# Altium project SR8_MPPT.PrjPcb (part 2 of 3)

## Sheet microcontroller.SchDoc: Microcontroller
size A3; DrawnBy: Angus Macdonald; SheetNumber: 2; SheetTotal: 5
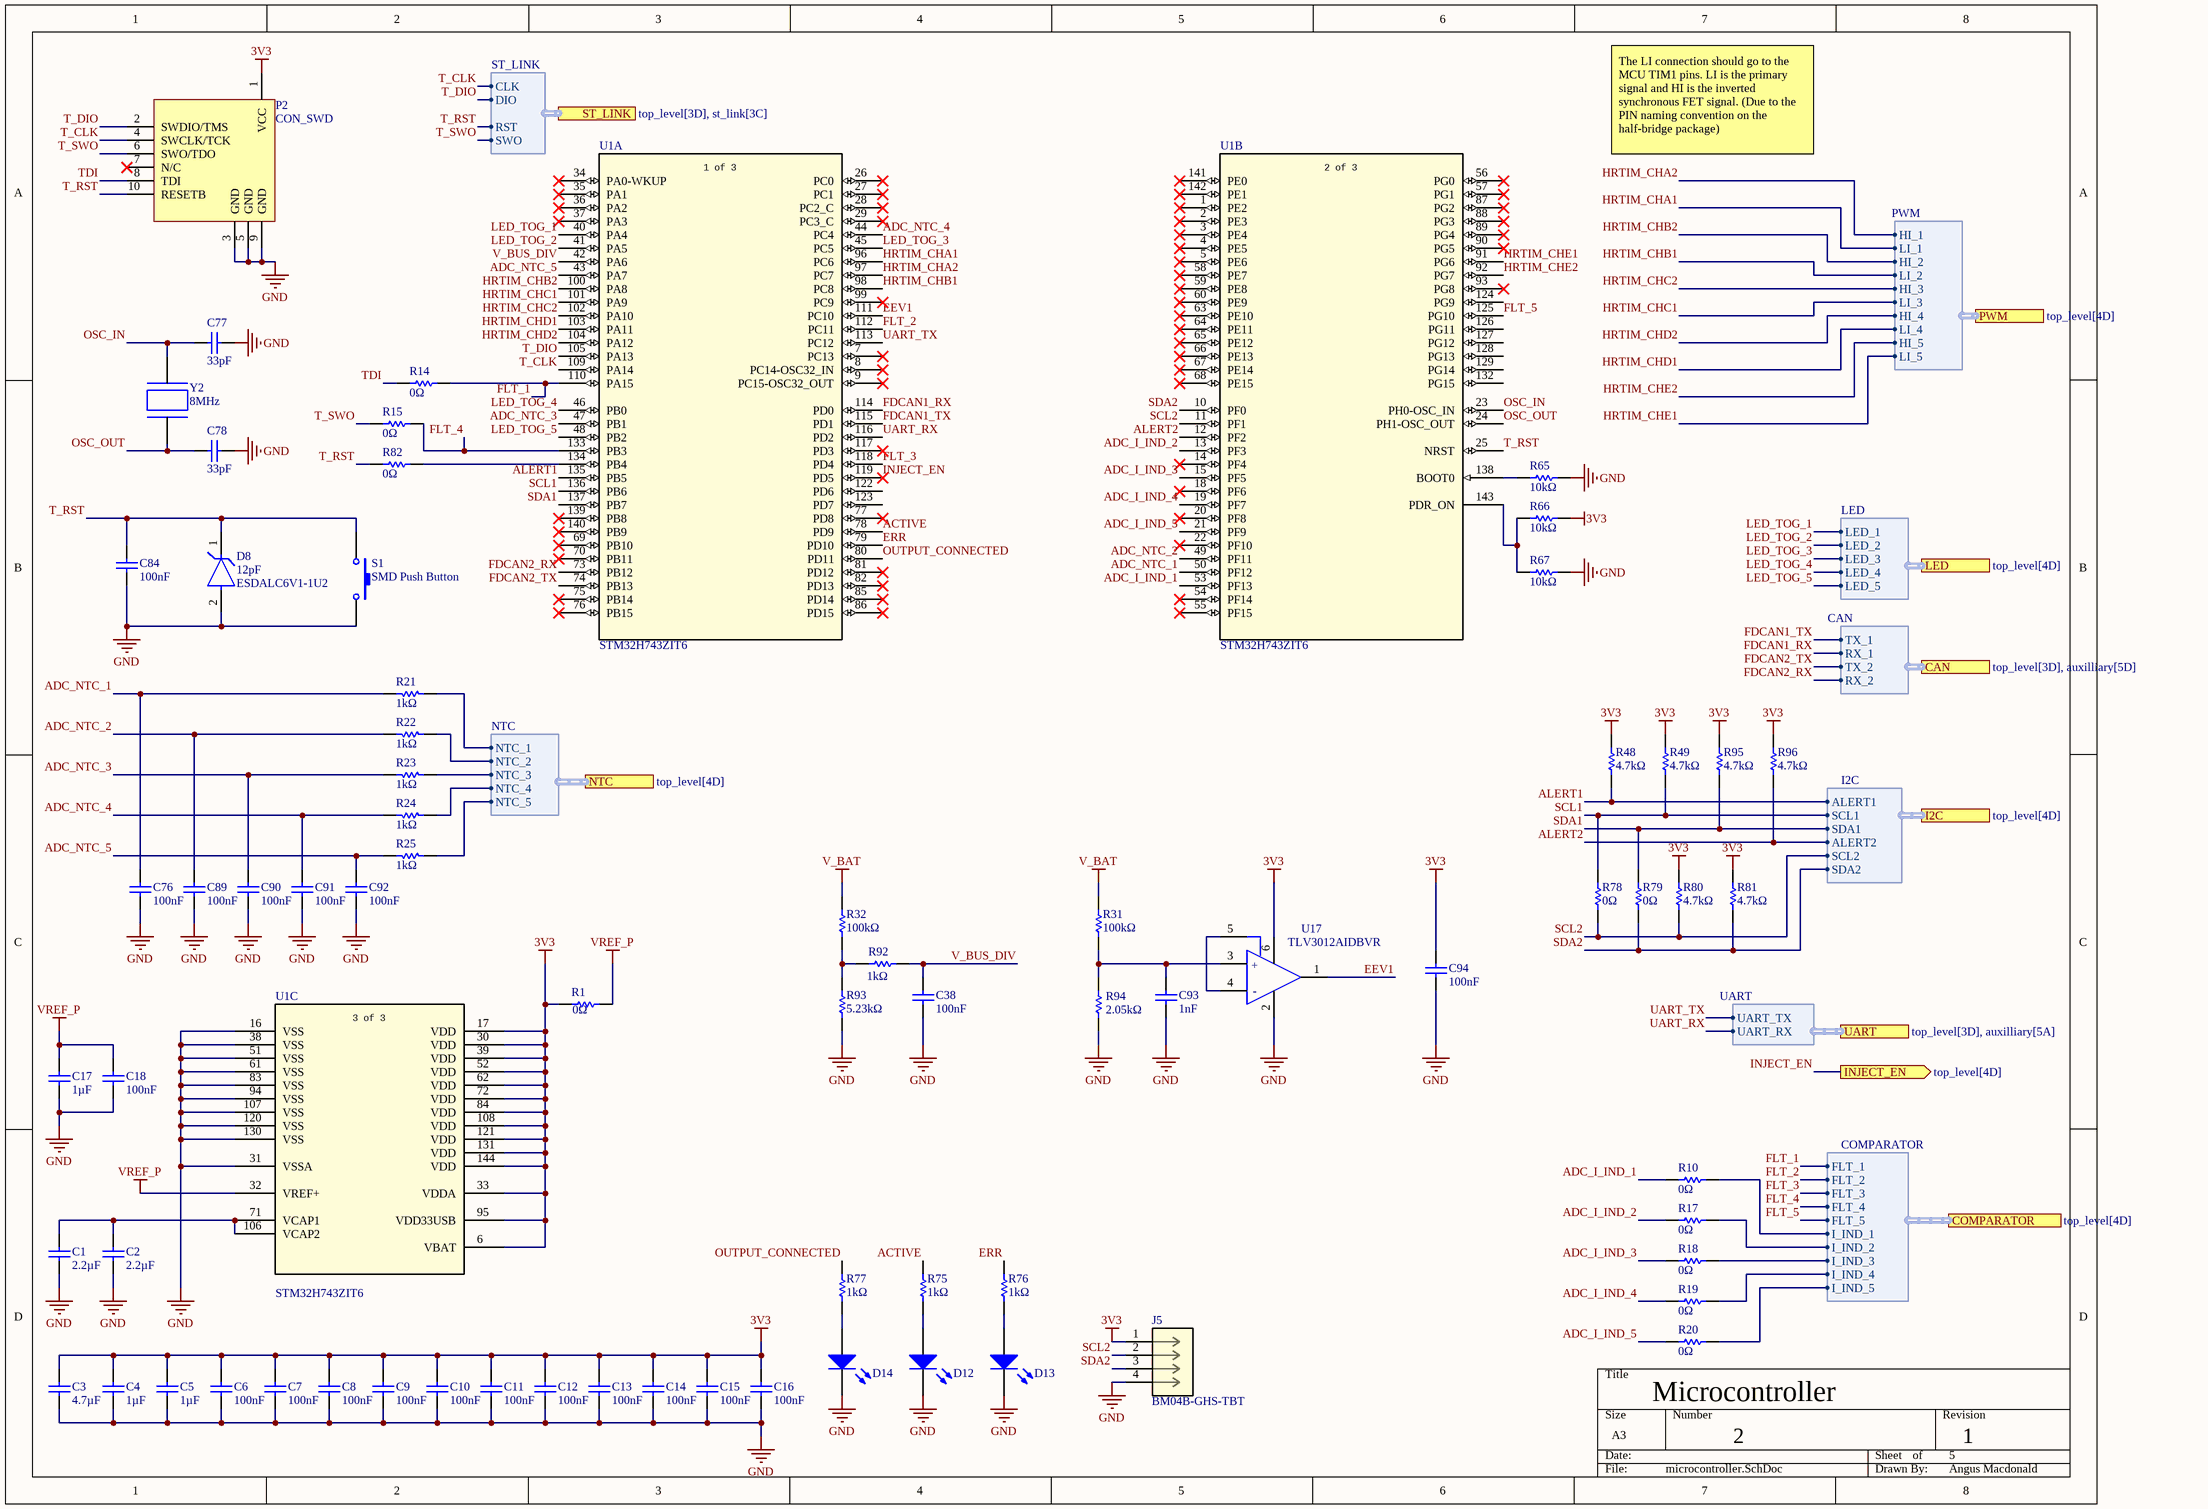
[diagram p2: microcontroller.SchDoc]

### Parts
C1  value 2.2µF  [C0603]  (hidden comment: CC0603KRX7R5BB225)
C2  value 2.2µF  [C0603]  (hidden comment: CC0603KRX7R5BB225)
C3  value 4.7µF  [C0603]  (hidden comment: CC0603MRX7R5BB475)
C4  value 1µF  [C0603]  (hidden comment: CC0603KRX7R7BB105)
C5  value 1µF  [C0603]  (hidden comment: CC0603KRX7R7BB105)
C6  value 100nF  [C0603]  (hidden comment: CC0603KRX7R8BB104)
C7  value 100nF  [C0603]  (hidden comment: CC0603KRX7R8BB104)
C8  value 100nF  [C0603]  (hidden comment: CC0603KRX7R8BB104)
C9  value 100nF  [C0603]  (hidden comment: CC0603KRX7R8BB104)
C10  value 100nF  [C0603]  (hidden comment: CC0603KRX7R8BB104)
C11  value 100nF  [C0603]  (hidden comment: CC0603KRX7R8BB104)
C12  value 100nF  [C0603]  (hidden comment: CC0603KRX7R8BB104)
C13  value 100nF  [C0603]  (hidden comment: CC0603KRX7R8BB104)
C14  value 100nF  [C0603]  (hidden comment: CC0603KRX7R8BB104)
C15  value 100nF  [C0603]  (hidden comment: CC0603KRX7R8BB104)
C16  value 100nF  [C0603]  (hidden comment: CC0603KRX7R8BB104)
C17  value 1µF  [C0603]  (hidden comment: CC0603KRX7R7BB105)
C18  value 100nF  [C0603]  (hidden comment: CC0603KRX7R8BB104)
C38  value 100nF  [C0603]  (hidden comment: CC0603KRX7R8BB104)
C76  value 100nF  [C0603]  (hidden comment: CC0603KRX7R8BB104)
C77  value 33pF  [C0603]  (hidden comment: CC0603JPNPO9BN330)
C78  value 33pF  [C0603]  (hidden comment: CC0603JPNPO9BN330)
C84  value 100nF  [C0603]  (hidden comment: CC0603KRX7R8BB104)
C89  value 100nF  [C0603]  (hidden comment: CC0603KRX7R8BB104)
C90  value 100nF  [C0603]  (hidden comment: CC0603KRX7R8BB104)
C91  value 100nF  [C0603]  (hidden comment: CC0603KRX7R8BB104)
C92  value 100nF  [C0603]  (hidden comment: CC0603KRX7R8BB104)
C93  value 1nF  [C0603]  (hidden comment: CC0603KRX7R9BB102)
C94  value 100nF  [C0603]  (hidden comment: CC0603KRX7R8BB104)
D8  ESDALC6V1-1U2  value 12pF  [FP-ST0201-MFG]
D12  LED EMERALD 0805  [0805 LED]  (value not drawn)
D13  LED RED 0805  [0805 LED]  (value not drawn)
D14  LED EMERALD 0805  [0805 LED]  (value not drawn)
J5  BM04B-GHS-TBT  [CONN_BM04B-GHS-TBT_JST]
P2  CON_SWD  [SMD, P=1.27mm]
R1  value 0Ω  [RESC1608X55X25ML10T15]  (hidden comment: RC0603JR-070RL)
R10  value 0Ω  [RESC1608X55X25ML10T15]  (hidden comment: RC0603JR-070RL)
R14  value 0Ω  [RESC1608X55X25ML10T15]  (hidden comment: RC0603JR-070RL)
R15  value 0Ω  [RESC1608X55X25ML10T15]  (hidden comment: RC0603JR-070RL)
R17  value 0Ω  [RESC1608X55X25ML10T15]  (hidden comment: RC0603JR-070RL)
R18  value 0Ω  [RESC1608X55X25ML10T15]  (hidden comment: RC0603JR-070RL)
R19  value 0Ω  [RESC1608X55X25ML10T15]  (hidden comment: RC0603JR-070RL)
R20  value 0Ω  [RESC1608X55X25ML10T15]  (hidden comment: RC0603JR-070RL)
R21  value 1kΩ  [RESC1608X55X25ML10T15]  (hidden comment: RC0603FR-101KL)
R22  value 1kΩ  [RESC1608X55X25ML10T15]  (hidden comment: RC0603FR-101KL)
R23  value 1kΩ  [RESC1608X55X25ML10T15]  (hidden comment: RC0603FR-101KL)
R24  value 1kΩ  [RESC1608X55X25ML10T15]  (hidden comment: RC0603FR-101KL)
R25  value 1kΩ  [RESC1608X55X25ML10T15]  (hidden comment: RC0603FR-101KL)
R31  value 100kΩ  [RESC1608X55X25ML10T15]  (hidden comment: RC0603FR-07100KL)
R32  value 100kΩ  [RESC1608X55X25ML10T15]  (hidden comment: RC0603FR-07100KL)
R48  value 4.7kΩ  [RESC1608X55X25ML10T15]  (hidden comment: RC0603FR-074K7L)
R49  value 4.7kΩ  [RESC1608X55X25ML10T15]  (hidden comment: RC0603FR-074K7L)
R65  value 10kΩ  [RESC1608X55X25ML10T15]  (hidden comment: RC0603FR-0710KL)
R66  value 10kΩ  [RESC1608X55X25ML10T15]  (hidden comment: RC0603FR-0710KL)
R67  value 10kΩ  [RESC1608X55X25ML10T15]  (hidden comment: RC0603FR-0710KL)
R75  value 1kΩ  [RESC1608X55X25ML10T15]  (hidden comment: RC0603FR-101KL)
R76  value 1kΩ  [RESC1608X55X25ML10T15]  (hidden comment: RC0603FR-101KL)
R77  value 1kΩ  [RESC1608X55X25ML10T15]  (hidden comment: RC0603FR-101KL)
R78  value 0Ω  [RESC1608X55X25ML10T15]  (hidden comment: RC0603JR-070RL)
R79  value 0Ω  [RESC1608X55X25ML10T15]  (hidden comment: RC0603JR-070RL)
R80  value 4.7kΩ  [RESC1608X55X25ML10T15]  (hidden comment: RC0603FR-074K7L)
R81  value 4.7kΩ  [RESC1608X55X25ML10T15]  (hidden comment: RC0603FR-074K7L)
R82  value 0Ω  [RESC1608X55X25ML10T15]  (hidden comment: RC0603JR-070RL)
R92  value 1kΩ  [RESC1608X55X25ML10T15]  (hidden comment: RC0603FR-101KL)
R93  value 5.23kΩ  [RESC1608X55X25ML10T15]  (hidden comment: RC0603FR-135K23L)
R94  value 2.05kΩ  [RESC1608X55X25ML10T15]  (hidden comment: RC0603FR-072K05L)
R95  value 4.7kΩ  [RESC1608X55X25ML10T15]  (hidden comment: RC0603FR-074K7L)
R96  value 4.7kΩ  [RESC1608X55X25ML10T15]  (hidden comment: RC0603FR-074K7L)
S1  SMD Push Button  [SMD Push Button-Footprint-1]
U1  STM32H743ZIT6  [LQFP144-20x20mm]  (parts A,B,C of 3)
U17  TLV3012AIDBVR  [FP-DBV0006A-IPC_B]
Y2  Frequency: 8MHz  [RESC5032X135N]  (hidden comment: X50328MSB2GI)

### Ports
CAN (harness CAN, see top_level[3D], auxilliary[5D]), COMPARATOR (harness COMPARATOR, see top_level[4D]), I2C (harness I2C, see top_level[4D]), INJECT_EN (out, see top_level[4D]), LED (harness LED, see top_level[4D]), NTC (harness NTC, see top_level[4D]), PWM (harness PWM, see top_level[4D]), ST_LINK (harness ST_LINK, see top_level[3D], st_link[3C]), UART (harness UART, see top_level[3D], auxilliary[5A])

### Harnesses
PWM: HI_1, HI_2, HI_3, HI_4, HI_5, LI_1, LI_2, LI_3, LI_4, LI_5
ST_LINK: CLK, DIO, RST, SWO
NTC: NTC_1, NTC_2, NTC_3, NTC_4, NTC_5
LED: LED_1, LED_2, LED_3, LED_4, LED_5
CAN: TX_1, RX_1, TX_2, RX_2
UART: UART_TX, UART_RX
I2C: ALERT1, SCL1, SDA1, ALERT2, SCL2, SDA2
COMPARATOR: FLT_1, FLT_2, FLT_3, FLT_4, FLT_5, I_IND_1, I_IND_2, I_IND_3, I_IND_4, I_IND_5

### Nets
3V3: C3.2 C4.2 C5.2 C6.2 C7.2 C8.2 C9.2 C10.2 C11.2 C12.2 C13.2 C14.2 C15.2 C16.2 C94.2 J5.1 P2.1(VCC) R1.1 R48.2 R49.2 R66.1 R80.2 R81.2 R95.2 R96.2 U1.6(VBAT) U1.17(VDD) U1.30(VDD) U1.33(VDDA) U1.39(VDD) U1.52(VDD) U1.62(VDD) U1.72(VDD) U1.84(VDD) U1.95(VDD33USB) U1.108(VDD) U1.121(VDD) U1.131(VDD) U1.144(VDD) U17.6(V+)
GND: C1.2 C2.2 C3.1 C4.1 C5.1 C6.1 C7.1 C8.1 C9.1 C10.1 C11.1 C12.1 C13.1 C14.1 C15.1 C16.1 C17.1 C18.1 C38.1 C76.1 C77.1 C78.1 C84.1 C89.1 C90.1 C91.1 C92.1 C93.1 C94.1 D8.2(A) D12.K D13.K D14.K J5.4 P2.3(GND) P2.5(GND) P2.9(GND) R65.2 R67.2 R93.1 R94.1 S1.2 U1.16(VSS) U1.31(VSSA) U1.38(VSS) U1.51(VSS) U1.61(VSS) U1.83(VSS) U1.94(VSS) U1.107(VSS) U1.120(VSS) U1.130(VSS) U17.2(V-)
V_BAT: R31.2 R32.2
VREF_P: C17.2 C18.2 R1.2 U1.32(VREF+)
ACTIVE: R75.1 U1.78(PD9)
ADC_I_IND_1: R10.2 U1.53(PF13)
ADC_I_IND_2: R17.2 U1.13(PF3)
ADC_I_IND_3: R18.2 U1.15(PF5)
ADC_I_IND_4: R19.2 U1.19(PF7)
ADC_I_IND_5: R20.2 U1.21(PF9)
ADC_NTC_1: C76.2 R21.2 U1.50(PF12)
ADC_NTC_2: C89.2 R22.2 U1.49(PF11)
ADC_NTC_3: C90.2 R23.2 U1.47(PB1)
ADC_NTC_4: C91.2 R24.2 U1.44(PC4)
ADC_NTC_5: C92.2 R25.2 U1.43(PA7)
ALERT1: R48.1 U1.135(PB5) ; port I2C.ALERT1
ALERT2: R96.1 U1.12(PF2) ; port I2C.ALERT2
EEV1: U1.111(PC10) U17.1(OUT)
ERR: R76.2 U1.79(PD10)
FDCAN1_RX: U1.114(PD0) ; port CAN.RX_1
FDCAN1_TX: U1.115(PD1) ; port CAN.TX_1
FDCAN2_RX: U1.73(PB12) ; port CAN.RX_2
FDCAN2_TX: U1.74(PB13) ; port CAN.TX_2
FLT_1: R14.1 U1.110(PA15) ; port COMPARATOR.FLT_1
FLT_2: U1.112(PC11) ; port COMPARATOR.FLT_2
FLT_3: U1.118(PD4) ; port COMPARATOR.FLT_3
FLT_4: R15.1 U1.133(PB3) ; port COMPARATOR.FLT_4
FLT_5: U1.125(PG10) ; port COMPARATOR.FLT_5
HRTIM_CHA1: U1.96(PC6) ; port PWM.LI_1  [project net LI_1]
HRTIM_CHA2: U1.97(PC7) ; port PWM.HI_1  [project net HI_1]
HRTIM_CHB1: U1.98(PC8) ; port PWM.LI_2  [project net LI_2]
HRTIM_CHB2: U1.100(PA8) ; port PWM.HI_2  [project net HI_2]
HRTIM_CHC1: U1.101(PA9) ; port PWM.LI_3  [project net LI_3]
HRTIM_CHC2: U1.102(PA10) ; port PWM.HI_3  [project net HI_3]
HRTIM_CHD1: U1.103(PA11) ; port PWM.LI_4  [project net LI_4]
HRTIM_CHD2: U1.104(PA12) ; port PWM.HI_4  [project net HI_4]
HRTIM_CHE1: U1.91(PG6) ; port PWM.LI_5  [project net LI_5]
HRTIM_CHE2: U1.92(PG7) ; port PWM.HI_5  [project net HI_5]
I_IND_1: R10.1 ; port COMPARATOR.I_IND_1
I_IND_2: R17.1 ; port COMPARATOR.I_IND_2
I_IND_3: R18.1 ; port COMPARATOR.I_IND_3
I_IND_4: R19.1 ; port COMPARATOR.I_IND_4
I_IND_5: R20.1 ; port COMPARATOR.I_IND_5
INJECT_EN: U1.119(PD5) ; port INJECT_EN
LED_TOG_1: U1.40(PA4) ; port LED.LED_1
LED_TOG_2: U1.41(PA5) ; port LED.LED_2
LED_TOG_3: U1.45(PC5) ; port LED.LED_3
LED_TOG_4: U1.46(PB0) ; port LED.LED_4
LED_TOG_5: U1.48(PB2) ; port LED.LED_5
NTC_1: R21.1 ; port NTC.NTC_1
NTC_2: R22.1 ; port NTC.NTC_2
NTC_3: R23.1 ; port NTC.NTC_3
NTC_4: R24.1 ; port NTC.NTC_4
NTC_5: R25.1 ; port NTC.NTC_5
OSC_IN: C77.2 U1.23(PH0-OSC_IN) Y2.2
OSC_OUT: C78.2 U1.24(PH1-OSC_OUT) Y2.1
OUTPUT_CONNECTED: R77.1 U1.80(PD11)
SCL1: R49.1 R78.2 U1.136(PB6) ; port I2C.SCL1
SCL2: J5.2 R78.1 R80.1 U1.11(PF1) ; port I2C.SCL2
SDA1: R79.2 R95.1 U1.137(PB7) ; port I2C.SDA1
SDA2: J5.3 R79.1 R81.1 U1.10(PF0) ; port I2C.SDA2
T_CLK: P2.4(SWCLK/TCK) U1.109(PA14) ; port ST_LINK.CLK
T_DIO: P2.2(SWDIO/TMS) U1.105(PA13) ; port ST_LINK.DIO
T_RST: C84.2 D8.1(C) P2.10(RESETB) R82.2 S1.1 U1.25(NRST) ; port ST_LINK.RST
T_SWO: P2.6(SWO/TDO) R15.2 ; port ST_LINK.SWO
TDI: P2.8(TDI) R14.2
UART_RX: U1.116(PD2) ; port UART.UART_RX
UART_TX: U1.113(PC12) ; port UART.UART_TX
V_BUS_DIV: C38.2 R92.2 U1.42(PA6)
NetC1_1: C1.1 C2.1 U1.71(VCAP1) U1.106(VCAP2)
NetC93_2: C93.2 R31.1 R94.2 U17.3(IN+)
NetD12_A: D12.A R75.2
NetD13_A: D13.A R76.1
NetD14_A: D14.A R77.2
NetR32_1: R32.1 R92.1 R93.2
NetR65_1: R65.1 U1.138(BOOT0)
NetR66_2: R66.2 R67.1 U1.143(PDR_ON)
NetR82_1: R82.1 U1.134(PB4)
NetU17_4: U17.4(IN-) U17.5(REF)

Not connected (* = marked no-connect by the designer): P2 7(N/C)*; U1 1(PE2)* 2(PE3)* 3(PE4)* 4(PE5)* 5(PE6)* 7(PC13)* 8(PC14-OSC32_IN)* 9(PC15-OSC32_OUT)* 14(PF4)* 18(PF6)* 20(PF8)* 22(PF10)* 26(PC0)* 27(PC1)* 28(PC2_C)* 29(PC3_C)* 34(PA0-WKUP)* 35(PA1)* 36(PA2)* 37(PA3)* 54(PF14)* 55(PF15)* 56(PG0)* 57(PG1)* 58(PE7)* 59(PE8)* 60(PE9)* 63(PE10)* 64(PE11)* 65(PE12)* 66(PE13)* 67(PE14)* 68(PE15)* 69(PB10)* 70(PB11)* 75(PB14)* 76(PB15)* 77(PD8)* 81(PD12)* 82(PD13)* 85(PD14)* 86(PD15)* 87(PG2)* 88(PG3)* 89(PG4)* 90(PG5)* 93(PG8)* 99(PC9)* 117(PD3)* 122(PD6) 123(PD7) 124(PG9) 126(PG11) 127(PG12) 128(PG13) 129(PG14) 132(PG15) 139(PB8)* 140(PB9)* 141(PE0)* 142(PE1)*

### Notes on the sheet
- The LI connection should go to the MCU TIM1 pins. LI is the primary signal and HI is the inverted synchronous FET signal. (Due to the PIN naming convention on the half-bridge package)
- (in symbol CMP-015-000045-1, part A) 1 of 3
- (in symbol CMP-015-000045-1, part B) 2 of 3
- (in symbol CMP-015-000045-1, part C) 3 of 3
- (in symbol CMP-365-000001-1) +; -

### Library data of the parts
C1 C2 = CMP-00207-1: 6.3V 2.2uF X7R ±10% 0603 Multilayer Ceramic Capacitors MLCC - SMD/SMT ROHS; Width: 800µm; Depth: 800µm; Packaging: Tape and Reel; Schedule B: 8532240020, 8532240020; Case Code (Imperial): 0603; Country of Origin: Mainland China, Taiwan; Halogen Free: Halogen Free; Length: 1.6mm; Lifecycle Status: Production; Dielectric Material: Ceramic; Min Operating Temperature: -55°C; Lead Free: Lead Free; Case/Package: 0603; Composition: Ceramic; Material: Ceramic; Termination: SMD/SMT; Radiation Hardening: No; Harmonized Tariff Schedule (HTS) Code: 8532.24.00.20; Thickness: 889µm; Mounting Technology: Surface Mount; Number of Terminals: 2; China RoHS: Compliant; Case Code (Metric): 1608; Introduction Date: 2009-04-17; RoHS: Compliant; Tolerance: 10%; REACH SVHC: Yes; Height: 800µm; Dielectric: X7R; Export Control Classification Number (ECCN) Code: EAR99; Voltage Rating (DC): 6.3V; Voltage Rating: 6.3V; Max Operating Temperature: 125°C; Weight: 2.012816mg
C3 = CMP-00209-1: Multilayer Ceramic Capacitors MLCC - SMD/SMT 6.3V 4.7uF X7R 0603 20%; Halogen Free: Halogen Free; Introduction Date: 2012-07-17; Number of Terminals: 2; Export Control Classification Number (ECCN) Code: EAR99; Tolerance: 20%; Lead Free: Lead Free; REACH SVHC: Yes; Min Operating Temperature: -55°C; Case/Package: 0603; Country of Origin: Mainland China, Taiwan; Height: 800µm; Dielectric Material: Ceramic; Mounting Technology: Surface Mount; Harmonized Tariff Schedule (HTS) Code: 8532.24.00.20; Voltage Rating: 6.3V; Lifecycle Status: Production; Dielectric: X7R; Voltage Rating (DC): 6.3V; China RoHS: Compliant; Max Operating Temperature: 125°C; RoHS: Compliant; Length: 1.6mm; Width: 800µm; Material: Ceramic; Schedule B: 8532240020
C4 C5 C17 = CMP-00211-1: 16V 1uF X7R ±10% 0603 Multilayer Ceramic Capacitors MLCC - SMD/SMT ROHS; Dissipation Factor: 5%; Harmonized Tariff Schedule (HTS) Code: 8532.24.00.20; Width: 800µm; Country of Origin: Mainland China, Taiwan; Case Code (Imperial): 0603; Schedule B: 8532240020, 8532240020; Halogen Free: Halogen Free; Lifecycle Status: Production; China RoHS: Compliant; Max Operating Temperature: 125°C; Export Control Classification Number (ECCN) Code: EAR99; Min Operating Temperature: -55°C; Radiation Hardening: No; Dielectric Material: Ceramic; Voltage: 16V; RoHS: Compliant; Voltage Rating (DC): 16V; Termination: SMD/SMT; Material: Ceramic; Mounting Technology: Surface Mount; Case Code (Metric): 1608; Case/Package: 0603; Depth: 800µm; Voltage Rating: 16V; Dielectric: X7R; Thickness: 889µm; Lead Free: Lead Free; Length: 1.6mm; REACH SVHC: Yes; Height: 800µm; Introduction Date: 2009-04-17; Tolerance: 10%; Composition: Ceramic; Number of Terminals: 2; Pins: 2
C6-C16 C18 C38 C76 C84 C89-C92 C94 = CMP-00179-1: 25V 100nF X7R ±10% 0603 Multilayer Ceramic Capacitors MLCC - SMD/SMT ROHS; Length: 1.6mm; Pins: 2; Case/Package: 0603; Composition: Ceramic; Lead Free: Lead Free; Lifecycle Status: Production; RoHS: Compliant; China RoHS: Compliant; Number of Terminals: 2; Max Operating Temperature: 125°C; Tolerance: 10%; Width: 800µm; Dielectric Material: Ceramic; Voltage Rating (DC): 25V; Depth: 800µm; Min Operating Temperature: -55°C; Halogen Free: Halogen Free; Mounting Technology: Surface Mount; Material: Ceramic; REACH SVHC: Yes; Case Code (Imperial): 0603; Height: 800µm; Schedule B: 8532240020, 8532240020; Voltage Rating: 25V; Thickness: 889µm; Termination: SMD/SMT; Dielectric: X7R; Radiation Hardening: No; Voltage: 25V; Case Code (Metric): 1608
C77 C78 = CMP-00295-1: 0603 33 pF 50 V ±5 % Tolerance C0G/NP0 SMT Multilayer Ceramic Capacitor; Tolerance: 5%; Voltage Rating (DC): 50V; Dielectric: C0G; Halogen Free: Halogen Free; Depth: 800µm; Export Control Classification Number (ECCN) Code: EAR99; Case/Package: 0603; RoHS: Compliant; Harmonized Tariff Schedule (HTS) Code: 8532.24.00.20; Lifecycle Status: Production; Dielectric Material: Ceramic; Number of Terminals: 2; Width: 800µm; Length: 1.6mm; Mounting Technology: Surface Mount; Composition: Ceramic; Lead Free: Lead Free; Max Operating Temperature: 125°C; Min Operating Temperature: -55°C; Country of Origin: Mainland China, Taiwan; REACH SVHC: Yes; Radiation Hardening: No; China RoHS: Compliant; Packaging: Tape and Reel; Height: 800µm; Introduction Date: 2003-08-13
C93 = CMP-00293-1: Surface Mount Ceramic Multilayer Capacitor 0.001uF 10% X7R 50V 0603 Paper T/R; Insulation Resistance: 100GΩ; Schedule B: 8532240020, 8532240020; Voltage Rating: 50V; Number of Terminals: 2; Voltage: 50V; Pins: 2; Dielectric Material: Ceramic; Case Code (Imperial): 0603; Dielectric: X7R; Thickness: 889µm; Height: 800µm; Length: 1.6mm; REACH SVHC: Yes; Lifecycle Status: Production; China RoHS: Compliant; Depth: 800µm; Lead Free: Lead Free; Termination: SMD/SMT; Max Operating Temperature: 125°C; Width: 800µm; Tolerance: 10%; Voltage Rating (DC): 50V; Mounting Technology: Surface Mount; RoHS: Compliant; Material: Ceramic; Case Code (Metric): 1608; Composition: Ceramic; Halogen Free: Halogen Free; Case/Package: 0603; Min Operating Temperature: -55°C; Radiation Hardening: No
D8 = CMP-002-000051-1: 20W 6.1V 6.1V 3V 0201 ESD and Surge Protection (TVS/ESD) ROHS; Direction: Unidirectional; Max Reverse Leakage Current: 100nA; Number of Channels: 1; Max Breakdown Voltage: 8V; ESD Protection: Yes; Clamping Voltage: 21V; Peak Pulse Current: 2A; Max Junction Temperature (Tj): 125°C; Element Configuration: Single; Power Line Protection: No; Test Current: 1mA; Breakdown Voltage: 7.05V; Depth: 300µm; China RoHS: Compliant; Export Control Classification Number (ECCN) Code: EAR99; Length: 600µm; Width: 350µm; Min Breakdown Voltage: 6.1V; Max Power Dissipation: 20W; Lead Free: Lead Free; RoHS: Compliant; Peak Reverse Current: 100nA; Max Operating Temperature: 125°C; Min Operating Temperature: -40°C; Polarity: Unidirectional; Case Code (Imperial): 0201; Number of Elements: 1; Leakage Current: 100nA; Radiation Hardening: No; Country of Origin: Mainland China; Number of Terminals: 2; Lifecycle Status: Obsolete; Max Repetitive Reverse Voltage (Vrrm): 3V; Schedule B: 8536300000, 8536300000; Number of Unidirectional Channels: 1; Pins: 2; Reverse Standoff Voltage: 3V; Peak Pulse Power: 20W; Harmonized Tariff Schedule (HTS) Code: 8541.10.00.50; Reverse Breakdown Voltage: 6.1V; Termination: SMD/SMT; Mounting Technology: Surface Mount; Case/Package: SMD/SMT; Composition: Zener; Power Dissipation: 20W; REACH SVHC: Yes; Height: 330µm; Introduction Date: 2008-10-13
D12 D14 = CMP-002-000017-2: Emerald 0805  Light Emitting Diodes (LED) ROHS GREEN JLCPCB PICK&PLACE; MFR.Part #: C2297; Manufacturer: Hubei KENTO Elec; Color: Emerald; JLCPCB Part #: C2297
D13 = CMP-002-000018-2: Red 0805  Light Emitting Diodes (LED) ROHS JLCPCB PICK&PLACE; Manufacturer: Foshan NationStar Optoelectronics; MFR.Part #: C84256; JLCPCB Part #: C84256; Color: Red
J5 = CMP-189-000000-2: Description; Manufacturer_Name: JST; Source: BM04B-GHS-TBT.SchLib; Copyright: Copyright (C) 2026 Ultra Librarian. All rights reserved.; Design Item ID: BM04B-GHS-TBT; Type: Type; Manufacturer_Part_Number: BM04B-GHS-TBT; RefDes: RefDes
P2 = CMP-CON-00005-10: ARM Coresight 10 Header; Manufacturer Part Number: 3220-10-0300-00; Value: FTSH-105-01-F-DV-K-P-TR; JLCPCB Part #: C5250218; ComponentLink1Description: Digikey; ComponentLink1URL: https://www.digikey.com.au/en/products/detail/cnc-tech/3220-10-0300-00/3883266?s=N4IgTCBcDaIIxwOwFYC0cBsYCcqByAIiALoC%2BQA
R1 R10 R14 R15 R17-R20 R78 R79 R82 = CMP-RES-00050-1: GENERAL PURPOSE CHIP RESISTOR Metal Glaze/thick Film, 0.1W, 0ohm, Surface Mount, 0603; Power Rating: 100mW; Tolerance: 1%; Voltage Rating: 50V; Temperature Coefficient: 200ppm/°C; Termination: SMD/SMT; Number of Terminals: 2; Pins: 2; Contact Plating: Tin; Case/Package: 0603; Length: 1.6mm; Military Standard: Not; Power Dissipation: 100mW; Introduction Date: 2001-06-08; Case Code (Imperial): 0603; Voltage Rating (DC): 50V; Min Operating Temperature: -55°C; Composition: Thick Film; Export Control Classification Number (ECCN) Code: EAR99; Country of Origin: Mainland China, Taiwan; Height: 450µm; RoHS: Compliant; Depth: 800µm; Lifecycle Status: Production; Width: 800µm; Max Operating Temperature: 155°C; Harmonized Tariff Schedule (HTS) Code: 8533.21.00.30; Radiation Hardening: No; Packaging: Cut Tape; China RoHS: Non-Compliant; Lead Free: Lead Free; REACH SVHC: Yes; Mounting Technology: Surface Mount
R21-R25 R75-R77 R92 = CMP-RES-00029-1: 1 kOhms ±1% 0.1W, 1/10W Chip Resistor 0603 (1608 Metric) Moisture Resistant Thick Film; Case/Package: 0603; Tolerance: 1%
R31 R32 = CMP-RES-00026-1: Res General Purpose Thick Film 0603 100k Ohm 1% 1/10W ±100ppm/°C Molded Paper T/R; Working Voltage: 75V; Voltage Rating (DC): 50V; Power Dissipation: 100mW; Tolerance: 1%; Number of Terminations: 2; Pins: 2; China RoHS: Non-Compliant; Schedule B: 8533210045, 8533210045; Military Standard: Not; Max Operating Temperature: 155°C; Depth: 800µm; Height: 450µm; Voltage Rating: 75V; Case/Package: 0603; Length: 1.6mm; Packaging: Tape & Reel; RoHS: Compliant; Width: 800µm; Power Rating: 100mW; Number of Terminals: 2; Case Code (Imperial): 0603; Lead Free: Lead Free; Termination: SMD/SMT; Case Code (Metric): 0603; Mounting Technology: Surface Mount; Composition: Thick Film; Min Operating Temperature: -55°C; REACH SVHC: Yes; Temperature Coefficient: 100ppm/°C; Lifecycle Status: Production
R48 R49 R80 R81 R95 R96 = CMP-RES-00087-1: Yageo RC0603FR-074K7L Resistor 0603 SMD 4.7k Ohm 1% 100mW Thick Film; Working Voltage: 75V; Voltage Rating (DC): 50V; Temperature Coefficient: 100ppm/°C; Pins: 2; Mounting Technology: Surface Mount; China RoHS: Non-Compliant; Number of Terminals: 2; Radiation Hardening: No; Export Control Classification Number (ECCN) Code: EAR99; Country of Origin: Mainland China, Taiwan; Packaging: Tape & Reel; REACH SVHC: Yes; Composition: Thick Film; Schedule B: 8533210045, 8533210045; Height: 450µm; Case/Package: 0603; Contact Plating: Tin; Tolerance: 1%; Length: 1.6mm; Termination: SMD/SMT; Lead Free: Lead Free; RoHS: Compliant; Power Rating: 100mW; Voltage Rating: 75V; Case Code (Imperial): 0603; Max Operating Temperature: 155°C; Width: 800µm; Depth: 800µm; Lifecycle Status: Production; Harmonized Tariff Schedule (HTS) Code: 8533.21.00.30; Introduction Date: 2004-09-22; Min Operating Temperature: -55°C; Lead Pitch: 300µm; Military Standard: Not
R65-R67 = CMP-RES-00040-1: 10 kOhms ±1% 0.1W, 1/10W Chip Resistor 0603 (1608 Metric) Moisture Resistant Thick Film; Tolerance: 1%; Case/Package: 0603
R93 = CMP-RES-00100-1: 0603 5.23K ohms 1% thick film surface mount chip resistor; Temperature Coefficient: 100ppm/°C; Working Voltage: 75V; Power Rating: 100mW; Voltage Rating: 50V; Mounting Technology: Surface Mount; Contact Plating: Tin; Harmonized Tariff Schedule (HTS) Code: 8533.21.00.30; Number of Terminals: 2; Lifecycle Status: Production; REACH SVHC: Yes; Introduction Date: 2004-09-22; RoHS: Compliant; Radiation Hardening: No; Termination: SMD/SMT; Export Control Classification Number (ECCN) Code: EAR99; Height: 450µm; Country of Origin: Mainland China, Taiwan; Composition: Thick Film; China RoHS: Non-Compliant; Tolerance: 1%; Width: 800µm; Max Operating Temperature: 155°C; Case Code (Imperial): 0603; Min Operating Temperature: -55°C; Case/Package: 0603; Case Code (Metric): 1608; Packaging: Tape & Reel; Length: 1.6mm
R94 = CMP-RES-00099-1: 100mW Thick Film Resistors 75V ±100ppm/℃ ±1% 2.05kΩ 0603 Chip Resistor - Surface Mount ROHS; Temperature Coefficient: 100ppm/°C; Voltage Rating (DC): 50V; Introduction Date: 2004-09-22; Power Rating: 100mW; Number of Terminations: 2; Schedule B: 8533210045, 8533210045; Max Power Dissipation: 100mW; Country of Origin: Mainland China, Taiwan; Number of Terminals: 2; Depth: 800µm; Military Standard: Not; Height: 450µm; Voltage Rating: 75V; Harmonized Tariff Schedule (HTS) Code: 8533.21.00.30; Working Voltage: 75V; Case/Package: 0603; Lifecycle Status: Production; Width: 800µm; Max Operating Temperature: 155°C; Composition: Thick Film; Lead Free: Lead Free; Mounting Technology: Surface Mount; Min Operating Temperature: -55°C; Length: 1.6mm; Export Control Classification Number (ECCN) Code: EAR99; Termination: SMD/SMT; China RoHS: Non-Compliant; REACH SVHC: Yes; Features: Moisture Resistant; Tolerance: 1%; RoHS: Compliant; Case Code (Imperial): 0603
S1 = CMP-011-00000-2: Tactile Switches SPST Rnd Bttn Gull .05A 32VDC 1W SMD; Manufacturer Part Number: KMR221GLFS; JLCPCB Part #: C72443; ComponentLink1URL: https://au.mouser.com/ProductDetail/CK/KMR221GLFS?qs=sb%252But3Lm4x2RtkMQYdEYMA%3D%3D; ComponentLink1Description: Mouser
U1 = CMP-015-000045-1: High-performance and DSP with DP-FPU, Arm Cortex-M7 MCU with 2MBytes of Flash memory, 1MB RAM, 480 MHz CPU, Art Accelerator, L1 cache, external memory interface, large set of peripherals; Manufacturer_Name: STMicroelectronics; Type: Type; Copyright: Copyright (C) 2025 Ultra Librarian. All rights reserved.; RefDes: RefDes; Source: STM32H743ZIT6.SchLib; Manufacturer_Part_Number: STM32H743ZIT6; Design Item ID: STM32H743ZIT6
U17 = CMP-365-000001-1: Low-power comparator with reference (push-pull) 6-SOT-23 -40 to 125; Manufacturer Lifecycle Status: ACTIVE; Input Bias Current: 1pA; Power Supply Rejection Ratio (PSRR): 80dB; Min Supply Voltage: 1.8V; Response Time: 6µs; Number of Channels: 1; Nominal Supply Current: 2.8µA; Output Current: 500µA; Max Junction Temperature (Tj): 150°C; Input Offset Voltage (Vos): 500µV; Common Mode Rejection Ratio: 74dB; Max Input Current: 10pA; Max Supply Voltage: 5.5V; Propagation Delay: 13.5µs; Max Supply Current: 5µA; Thickness: 1.2mm; Radiation Hardening: No; Pins: 6; RoHS: Compliant; Number of Elements: 1; Min Operating Temperature: -40°C; Length: 2.9mm; Max Operating Temperature: 85°C; Contact Plating: Gold; Width: 1.6mm; Case/Package: SOT-23; Lifecycle Status: Production; Mounting Technology: Surface Mount; Lead Free: Lead Free; REACH SVHC: No; Schedule B: 8542390000, 8542390000; Height: 0m; Quiescent Current: 5µA
Y2 = CMP-002-000019-2: 8MHz 20pF ±10ppm SMD5032-2P Crystals ROHS JLCPCB PICK&PLACE; Manufacturer: Yangxing Tech; JLCPCB Part #: C115962; MFR.Part #: X50328MSB2GI

## Sheet st_link.SchDoc: ST-Link
size A3; DrawnBy: Angus Macdonald; SheetNumber: 5; SheetTotal: 5
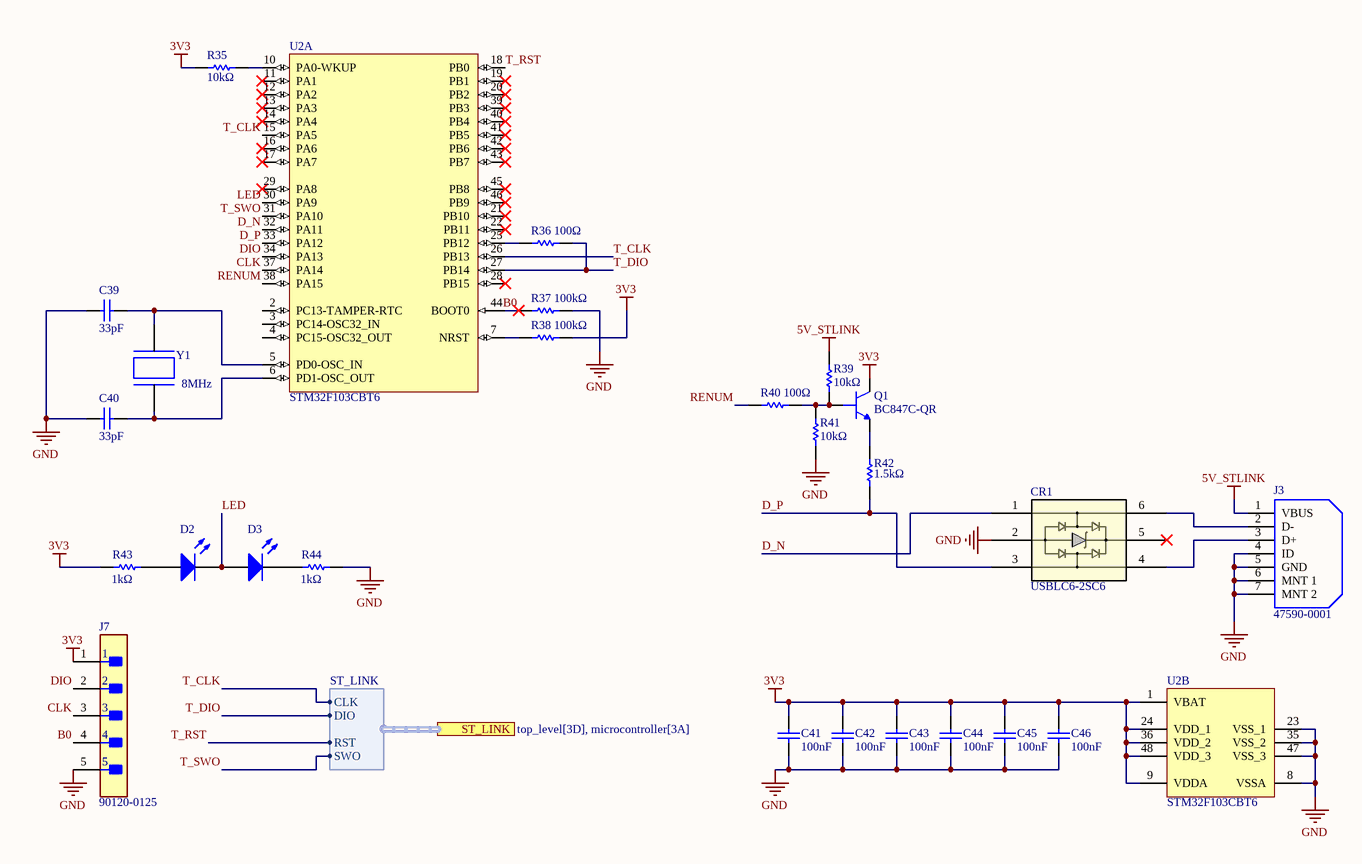
[diagram p3: st_link.SchDoc]

### Parts
C39  value 33pF  [C0603]  (hidden comment: CC0603JPNPO9BN330)
C40  value 33pF  [C0603]  (hidden comment: CC0603JPNPO9BN330)
C41  value 100nF  [C0603]  (hidden comment: CC0603KRX7R8BB104)
C42  value 100nF  [C0603]  (hidden comment: CC0603KRX7R8BB104)
C43  value 100nF  [C0603]  (hidden comment: CC0603KRX7R8BB104)
C44  value 100nF  [C0603]  (hidden comment: CC0603KRX7R8BB104)
C45  value 100nF  [C0603]  (hidden comment: CC0603KRX7R8BB104)
C46  value 100nF  [C0603]  (hidden comment: CC0603KRX7R8BB104)
CR1  USBLC6-2SC6  [SOT23-6L_STM]
D2  LED EMERALD 0805  [0805 LED]  (value not drawn)
D3  LED RED 0805  [0805 LED]  (value not drawn)
J3  47590-0001  [USB]
J7  90120-0125  [FP-90120-0125-MFG]
Q1  BC847C-QR  [TO-236AB-3]
R35  value 10kΩ  [RESC1608X55X25ML10T15]  (hidden comment: RC0603FR-0710KL)
R36  value 100Ω  [RESC1608X55X25ML10T15]  (hidden comment: RC0603FR-07100RL)
R37  value 100kΩ  [RESC1608X55X25ML10T15]  (hidden comment: RC0603FR-07100KL)
R38  value 100kΩ  [RESC1608X55X25ML10T15]  (hidden comment: RC0603FR-07100KL)
R39  value 10kΩ  [RESC1608X55X25ML10T15]  (hidden comment: RC0603FR-0710KL)
R40  value 100Ω  [RESC1608X55X25ML10T15]  (hidden comment: RC0603FR-07100RL)
R41  value 10kΩ  [RESC1608X55X25ML10T15]  (hidden comment: RC0603FR-0710KL)
R42  value 1.5kΩ  [RESC1608X55X25ML10T15]  (hidden comment: RC0603JR-071K5L)
R43  value 1kΩ  [RESC1608X55X25ML10T15]  (hidden comment: RC0603FR-101KL)
R44  value 1kΩ  [RESC1608X55X25ML10T15]  (hidden comment: RC0603FR-101KL)
U2  STM32F103CBT6  [STM-LQFP48_N]  (parts A,B of 2)
Y1  Frequency: 8MHz  [RESC5032X135N]  (hidden comment: X50328MSB2GI)

### Ports
ST_LINK (harness ST_LINK, see top_level[3D], microcontroller[3A])

### Harnesses
ST_LINK: CLK, DIO, RST, SWO

### Nets
3V3: C41.2 C42.2 C43.2 C44.2 C45.2 C46.2 J7.1 Q1.3(Collector) R35.2 R38.2 R43.1 U2.1(VBAT) U2.9(VDDA) U2.24(VDD_1) U2.36(VDD_2) U2.48(VDD_3)
5V_STLINK: J3.1(VBUS) R39.1
GND: C39.1 C40.2 C41.1 C42.1 C43.1 C44.1 C45.1 C46.1 CR1.2 J3.4(ID) J3.5(GND) J3.6(MNT_1) J3.7(MNT_2) J7.5 R37.2 R41.2 R44.2 U2.8(VSSA) U2.23(VSS_1) U2.35(VSS_2) U2.47(VSS_3)
B0: J7.4 R37.1 U2.44(BOOT0)
CLK: J7.3 U2.37(PA14)
D_N: CR1.1 U2.32(PA11)
D_P: CR1.3 R42.1 U2.33(PA12)
DIO: J7.2 U2.34(PA13)
LED: D2.K D3.A U2.30(PA9)
RENUM: R40.1 U2.38(PA15)
T_CLK: U2.15(PA5) U2.26(PB13) ; port ST_LINK.CLK
T_DIO: R36.2 U2.27(PB14) ; port ST_LINK.DIO
T_RST: U2.18(PB0) ; port ST_LINK.RST
T_SWO: U2.31(PA10) ; port ST_LINK.SWO
NetC39_2: C39.2 U2.5(PD0-OSC_IN) Y1.2
NetC40_1: C40.1 U2.6(PD1-OSC_OUT) Y1.1
NetCR1_4: CR1.4 J3.3(D+)
NetCR1_6: CR1.6 J3.2(D-)
NetD2_A: D2.A R43.2
NetD3_K: D3.K R44.1
NetQ1_1: Q1.1(Base) R39.2 R40.2 R41.1
NetQ1_2: Q1.2(Emitter) R42.2
NetR35_1: R35.1 U2.10(PA0-WKUP)
NetR36_1: R36.1 U2.25(PB12)
NetR38_1: R38.1 U2.7(NRST)

Not connected (* = marked no-connect by the designer): CR1 5*; U2 2(PC13-TAMPER-RTC) 3(PC14-OSC32_IN) 4(PC15-OSC32_OUT) 11(PA1)* 12(PA2)* 13(PA3)* 14(PA4)* 16(PA6)* 17(PA7)* 19(PB1)* 20(PB2)* 21(PB10)* 22(PB11)* 28(PB15)* 29(PA8)* 39(PB3)* 40(PB4)* 41(PB5)* 42(PB6)* 43(PB7)* 45(PB8)* 46(PB9)*

### Library data of the parts
C39 C40 = CMP-00295-1: as C77 on sheet microcontroller; Halogen Free: Halogen Free; Depth: 800µm; Export Control Classification Number (ECCN) Code: EAR99; Case/Package: 0603; RoHS: Compliant; Harmonized Tariff Schedule (HTS) Code: 8532.24.00.20; Lifecycle Status: Production; Dielectric Material: Ceramic; Number of Terminals: 2; Width: 800µm; Length: 1.6mm; Mounting Technology: Surface Mount; Composition: Ceramic; Lead Free: Lead Free; Max Operating Temperature: 125°C; Min Operating Temperature: -55°C; Country of Origin: Mainland China, Taiwan; REACH SVHC: Yes; Radiation Hardening: No; China RoHS: Compliant; Packaging: Tape and Reel; Height: 800µm; Introduction Date: 2003-08-13
C41-C46 = CMP-00179-1: as C6 on sheet microcontroller; Length: 1.6mm; Pins: 2; Case/Package: 0603; Composition: Ceramic; Lead Free: Lead Free; Lifecycle Status: Production; RoHS: Compliant; China RoHS: Compliant; Number of Terminals: 2; Max Operating Temperature: 125°C; Tolerance: 10%; Width: 800µm; Dielectric Material: Ceramic; Voltage Rating (DC): 25V; Depth: 800µm; Min Operating Temperature: -55°C; Halogen Free: Halogen Free; Mounting Technology: Surface Mount; Material: Ceramic; REACH SVHC: Yes; Case Code (Imperial): 0603; Height: 800µm; Schedule B: 8532240020, 8532240020; Voltage Rating: 25V; Thickness: 889µm; Termination: SMD/SMT; Dielectric: X7R; Radiation Hardening: No; Voltage: 25V; Case Code (Metric): 1608
CR1 = CMP-304-000000-1: ESD Protection for USB 2.0 High Speed; Manufacturer_Name: STMicroelectronics; Type: Type; Design Item ID: USBLC6-2SC6; RefDes: RefDes; Source: USBLC6-2SC6.SchLib; Manufacturer_Part_Number: USBLC6-2SC6; Copyright: Copyright (C) 2025 Ultra Librarian. All rights reserved.
D2 = CMP-002-000017-2: as D12 on sheet microcontroller; Color: Emerald; JLCPCB Part #: C2297
D3 = CMP-002-000018-2: as D13 on sheet microcontroller; JLCPCB Part #: C84256; Color: Red
J3 = CMP-014-000015-2: USB Connector Micro-AB SMD, 5 Contact(s), Female, Right Angle, Surface Mount Terminal, Locking, Receptacle, JLCPCB, PICK&PLACE; Manufacturer: MOLEX; MFR.Part #: 475900001; Source: https://jlcpcb.com/partdetail/Molex-475900001/C136001; JLCPCB Part #: C136001
J7 = CMP-014-000025-1: Board Connector, 5 Contact(s), 1 Row(s), Male, Straight, 0.1 inch Pitch, Solder Terminal, Black Insulator, Receptacle; Withdrawl Force-Min: 0.1946N; PCB Contact Pattern: RECTANGULAR; IEC Conformance: No; Reliability: COMMERCIAL; Mating Information: MULTIPLE MATING PARTS AVAILABLE; Number Of Connectors: 1; Insertion Force-Max: 3.0024N; Insulation Resistance: 5GR; Option: General Purpose; Contact Style: SQ PIN-SKT; Body Depth: 0.098inch; Plating Thickness: 160uin; Number of Contacts: 5; Contact Resistance: 20mR; Reference Standard: UL; Dielectric Withstanding Voltage (DC): 350V; Body Length: 0.5inch; Rated Current (Signal): 3A; Min Operating Temperature: -55°C; Mating Contact Pitch: 0.1inch; Body/Shell Style: RECEPTACLE; Flammability Rating: UL94 V-0; Mounting Style: STRAIGHT; Mixed Contacts: No; Contact Finish - Mating: NOT SPECIFIED; RoHS Compliant: Yes; Contact Material: Copper Alloy; MIL Conformance: No; Connector Type: BOARD CONNECTOR; JESD-609 Code: e4; Filter Feature: No; DIN Conformance: No; Terminal Length: 0.114inch; Body Breadth: 0.1inch; Contact Gender: Male; Insulation Color: Black; Mounting Technology: Board; Termination: Solder; Terminal Pitch: 2.54mm; Contact Finish - Termination: Gold (Au); Number Of PCB Rows: 1; Max Operating Temperature: 125°C; Contact Pattern: RECTANGULAR; Number of Rows Loaded: 1; Reach SVHC Compliant: Yes; Insulation Material: Glass
Q1 = CMP-001-0003-7: NPN general-purpose transistors in a small SOT23 (TO-236AB) Surface-Mounted Device (SMD); ComponentLink1URL: https://au.mouser.com/ProductDetail/Nexperia/BC847C-QR?qs=e8oIoAS2J1RqA3Lgar2wrA%3D%3D; ComponentLink1Description: Mouser; Manufacturer Part Number: BC847C-QR; JLCPCB Part #: C5336792
R35 R39 R41 = CMP-RES-00040-1: as R65 on sheet microcontroller; Tolerance: 1%; Case/Package: 0603
R36 R40 = CMP-RES-00083-1: Yageo RC0603FR-07100RL 0603 SMD Resistor 100 Ohm thin film chip resistor; Temperature Coefficient: 100ppm/°C; Working Voltage: 75V; Power Dissipation: 100mW; Voltage Rating (DC): 50V; Tolerance: 1%; Lead Free: Lead Free; Lifecycle Status: Production; Packaging: Cut Tape (CT); Height: 450µm; Pins: 2; Contact Plating: Tin; Mounting Technology: Surface Mount; Length: 1.6mm; Termination: SMD/SMT; Max Operating Temperature: 155°C; Width: 800µm; Case Code (Metric): 0603; Power Rating: 100mW; Voltage Rating: 75V; RoHS: Compliant; Depth: 800µm; Military Standard: Not; Min Operating Temperature: -55°C; Composition: Thick Film; Radiation Hardening: No; Case/Package: 0603; REACH SVHC: Yes; Number of Terminals: 2; Case Code (Imperial): 0603; China RoHS: Non-Compliant; Schedule B: 8533210045, 8533210045
R37 R38 = CMP-RES-00026-1: as R31 on sheet microcontroller; Tolerance: 1%; Number of Terminations: 2; Pins: 2; China RoHS: Non-Compliant; Schedule B: 8533210045, 8533210045; Military Standard: Not; Max Operating Temperature: 155°C; Depth: 800µm; Height: 450µm; Voltage Rating: 75V; Case/Package: 0603; Length: 1.6mm; Packaging: Tape & Reel; RoHS: Compliant; Width: 800µm; Power Rating: 100mW; Number of Terminals: 2; Case Code (Imperial): 0603; Lead Free: Lead Free; Termination: SMD/SMT; Case Code (Metric): 0603; Mounting Technology: Surface Mount; Composition: Thick Film; Min Operating Temperature: -55°C; REACH SVHC: Yes; Temperature Coefficient: 100ppm/°C; Lifecycle Status: Production
R42 = CMP-RES-00084-1: Res General Purpose Thick Film 0603 1.5k Ohm 5% 1/10W ±100ppm/°C Molded Paper T/R; Voltage Rating (DC): 50V; Working Voltage: 75V; Power Rating: 100mW; Lifecycle Status: Production; Weight: 2.012816mg; China RoHS: Non-Compliant; Pins: 2; Lead Free: Lead Free; Composition: Thick Film; Length: 1.6mm; Max Operating Temperature: 155°C; Mounting Technology: Surface Mount; Features: Moisture Resistant; Temperature Coefficient: 100ppm/°C; Termination: SMD/SMT; Case Code (Imperial): 0603; Military Standard: Not; REACH SVHC: Yes; Voltage Rating (AC): 50V; Number of Terminations: 2; Packaging: Tape & Reel; Height: 450µm; Schedule B: 8533210045, 8533210045; Depth: 800µm; Tolerance: 5%; Radiation Hardening: No; Power Dissipation: 100mW; Number of Terminals: 2; Max Power Dissipation: 100mW; Min Operating Temperature: -55°C; RoHS: Compliant; Voltage Rating: 75V; Case/Package: 0603; Contact Plating: Tin; Width: 800µm
R43 R44 = CMP-RES-00029-1: as R21 on sheet microcontroller; Case/Package: 0603; Tolerance: 1%
U2 = CMP-015-000003-2: RISC Microcontroller, 32-Bit, FLASH, CORTEX-M3 CPU, 72MHz, CMOS, PQFP48; JLCPCB Part #: C8304
Y1 = CMP-002-000019-2: as Y2 on sheet microcontroller; JLCPCB Part #: C115962; MFR.Part #: X50328MSB2GI